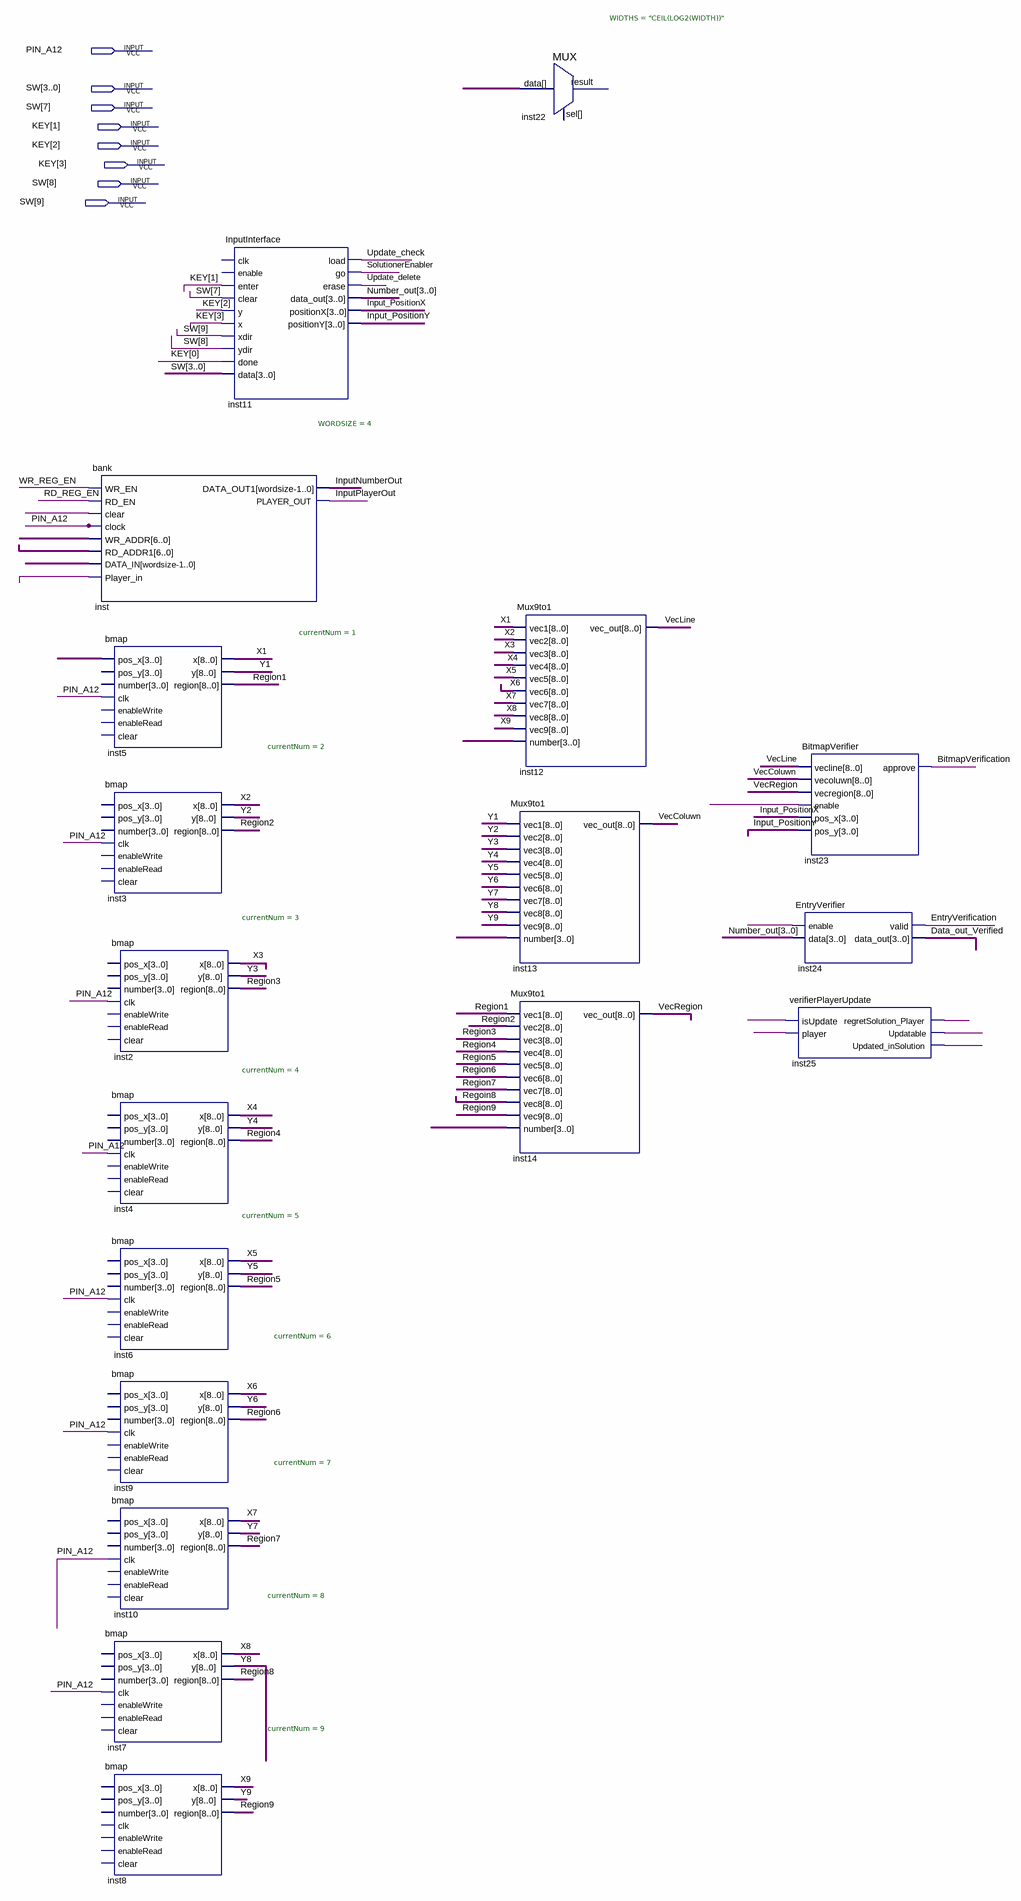
[diagram p0: schematic sheet]
// Quartus schematic Sudoku_Input.bdf as structural Verilog: 18 symbols, 8 pins
module Sudoku_Input (
  input  PIN_A12,
  input  [9:0] SW,
  input  [3:0] KEY
);

  wire BitmapVerification, Data_out_Verified, EntryVerification, Input_PositionX, Input_PositionY,
       InputNumberOut, InputPlayerOut, inst25_regretsolution_player, inst25_updatable,
       inst25_updated_insolution, RD_REG_EN, Region1, Region2, Region3, Region4, Region5, Region6, Region7,
       Region8, Region9, Regoin8, SolutionerEnabler, undriven_4, undriven_8, undriven_10, undriven_11,
       undriven_12, undriven_13, undriven_14, Update_check, Update_delete, VecColuwn, VecLine, VecRegion,
       WR_REG_EN, X1, X2, X3, X4, X5, X6, X7, X8, X9, Y1, Y2, Y3, Y4, Y5, Y6, Y7, Y8, Y9;
  wire [3:0] Number_out, undriven, undriven_2, undriven_3, undriven_7, undriven_9;
  wire [6:0] undriven_5, undriven_6;

  bank #(.WORDSIZE(4)) inst (
    .WR_EN(WR_REG_EN), .RD_EN(RD_REG_EN), .clear(undriven_4), .clock(PIN_A12), .WR_ADDR(undriven_5),
    .RD_ADDR1(undriven_6), .DATA_IN(undriven_7), .Player_in(undriven_8), .DATA_OUT1(InputNumberOut),
    .PLAYER_OUT(InputPlayerOut));
  bmap #(.currentNum(1)) inst5 (
    .pos_x(undriven_9), .clk(PIN_A12), .x(X1), .y(Y1), .region(Region1));  // open: pos_y, number, enableWrite, enableRead, clear
  bmap #(.currentNum(2)) inst3 (
    .clk(PIN_A12), .x(X2), .y(Y2), .region(Region2));  // open: pos_x, pos_y, number, enableWrite, enableRead, clear
  bmap #(.currentNum(3)) inst2 (
    .clk(PIN_A12), .x(X3), .y(Y3), .region(Region3));  // open: pos_x, pos_y, number, enableWrite, enableRead, clear
  bmap #(.currentNum(4)) inst4 (
    .clk(PIN_A12), .x(X4), .y(Y4), .region(Region4));  // open: pos_x, pos_y, number, enableWrite, enableRead, clear
  bmap #(.currentNum(5)) inst6 (
    .clk(PIN_A12), .x(X5), .y(Y5), .region(Region5));  // open: pos_x, pos_y, number, enableWrite, enableRead, clear
  bmap #(.currentNum(6)) inst9 (
    .clk(PIN_A12), .x(X6), .y(Y6), .region(Region6));  // open: pos_x, pos_y, number, enableWrite, enableRead, clear
  bmap #(.currentNum(7)) inst10 (
    .clk(PIN_A12), .x(X7), .y(Y7), .region(Region7));  // open: pos_x, pos_y, number, enableWrite, enableRead, clear
  bmap #(.currentNum(8)) inst7 (
    .clk(PIN_A12), .x(X8), .y(Y8), .region(Region8));  // open: pos_x, pos_y, number, enableWrite, enableRead, clear
  bmap #(.currentNum(9)) inst8 (
    .x(X9), .y(Y9), .region(Region9));  // open: pos_x, pos_y, number, clk, enableWrite, enableRead, clear
  InputInterface inst11 (
    .enter(KEY[1]), .clear(SW[7]), .y(KEY[2]), .x(KEY[3]), .xdir(SW[9]), .ydir(SW[8]), .done(KEY[0]),
    .data(SW[3:0]), .load(Update_check), .go(SolutionerEnabler), .erase(Update_delete),
    .data_out(Number_out), .positionX(Input_PositionX), .positionY(Input_PositionY));  // open: clk, enable
  MUX #(.WIDTHS("CEIL(LOG2(WIDTH))")) inst22 (.data(undriven_10));  // open: sel, result
  Mux9to1 inst12 (
    .vec1({9{X1}}), .vec2({9{X2}}), .vec3({9{X3}}), .vec4({9{X4}}), .vec5({9{X5}}), .vec6({9{X6}}),
    .vec7({9{X7}}), .vec8({9{X8}}), .vec9({9{X9}}), .number(undriven), .vec_out(VecLine));
  Mux9to1 inst13 (
    .vec1({9{Y1}}), .vec2({9{Y2}}), .vec3({9{Y3}}), .vec4({9{Y4}}), .vec5({9{Y5}}), .vec6({9{Y6}}),
    .vec7({9{Y7}}), .vec8({9{Y8}}), .vec9({9{Y9}}), .number(undriven_2), .vec_out(VecColuwn));
  Mux9to1 inst14 (
    .vec1({9{Region1}}), .vec2({9{Region2}}), .vec3({9{Region3}}), .vec4({9{Region4}}), .vec5({9{Region5}}),
    .vec6({9{Region6}}), .vec7({9{Region7}}), .vec8({9{Regoin8}}), .vec9({9{Region9}}), .number(undriven_3),
    .vec_out(VecRegion));
  verifierPlayerUpdate inst25 (
    .isUpdate(undriven_14), .player(undriven_13), .regretSolution_Player(inst25_regretsolution_player),
    .Updatable(inst25_updatable), .Updated_inSolution(inst25_updated_insolution));
  BitmapVerifier inst23 (
    .vecline({9{VecLine}}), .vecoluwn({9{VecColuwn}}), .vecregion({9{VecRegion}}), .enable(undriven_11),
    .pos_x({4{Input_PositionX}}), .pos_y({4{Input_PositionY}}), .approve(BitmapVerification));
  EntryVerifier inst24 (
    .enable(undriven_12), .data(Number_out), .valid(EntryVerification), .data_out(Data_out_Verified));
endmodule
